# EasyEDA Pro project 小张FOC-STM32G431CBU6.epro, board PCB4
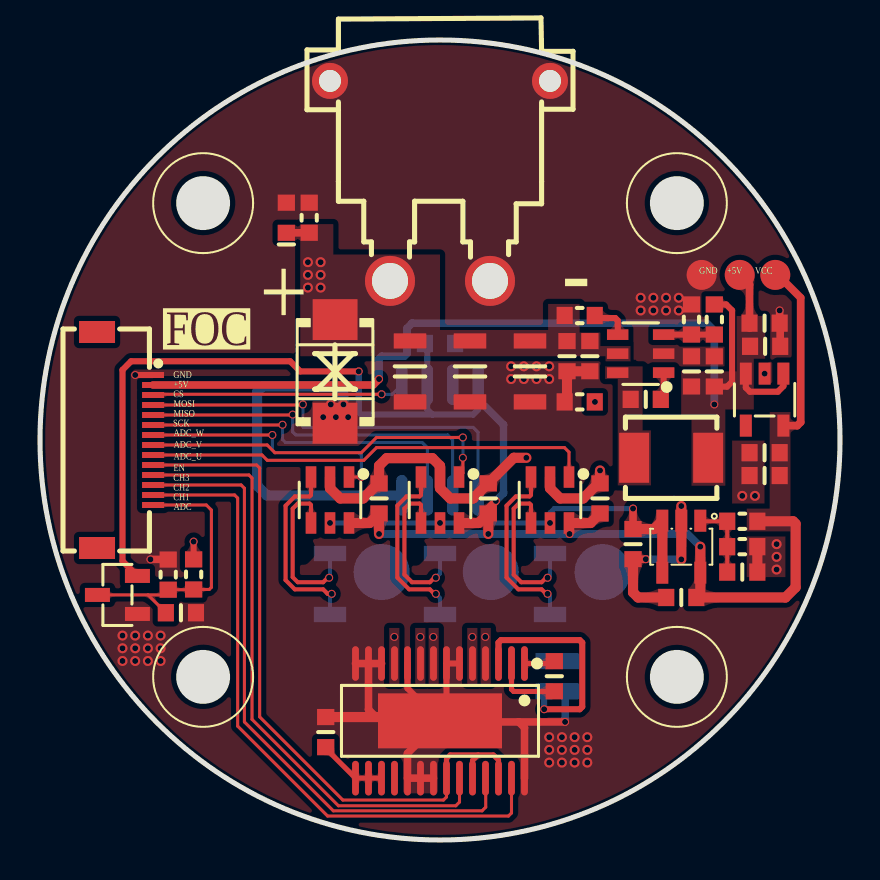
[diagram p9: board, top side]
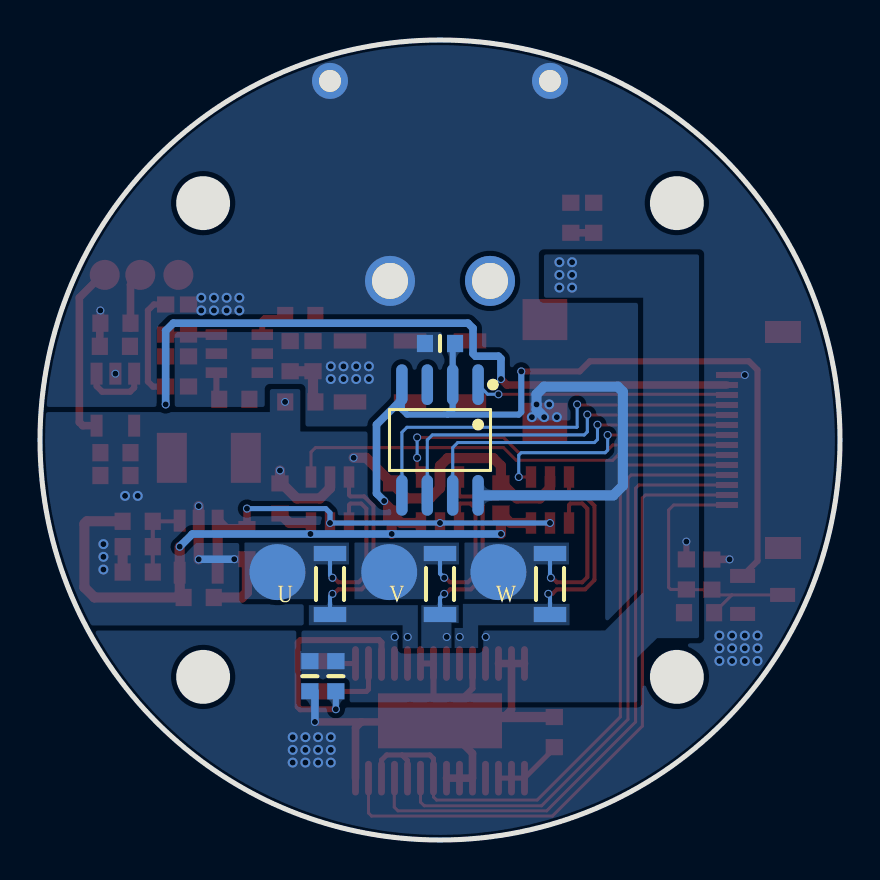
[diagram p10: board, bottom side, seen from below]

Outline 40 x 40 mm; copper layers: Top Layer, Bottom Layer. Coordinates in mm from the lower left corner of the outline.
Outline path: circle c20,20 r20
Stack: Top Layer 0.035mm - / Dielectric1 1.51mm FR4 er 4.5 / Bottom Layer 0.035mm -

## Design rules (mm)
template: 自定义配置
spacing copperThickness1oz (default): track to track 0.102, other pairs 0.102 to 0.127
spacing copperThickness2oz: track to track 0.203, other pairs 0.152 to 0.3
track width copperThickness1oz (default): min 0.127, default 0.152, max 2.54
track width copperThickness2oz: min 0.203, default 0.254, max 2.54
differential pair differentialPair (default): width min 0.127, default 0.152, max 2.54; gap min 0.152, default 0.152
via viaSize (default): diameter min 0.399, default 0.5, max 10; hole min 0.3, default 0.3, max 6.299

## Placement (name value [footprint] x y rotation side)
C1  10nF  [C0603_SMALL]  25.72 8.19 90 top
C2  100nF  [C0603_SMALL]  25.21 8.19 270 bottom
C3  100nF  [C0603_SMALL]  30.29 22.03 180 top
C4  10uF  [C0603_SMALL]  26.35 24.19 270 top
C5  10uF  [C0603_SMALL]  27.49 24.19 270 top
C6  10uF  [C0603_SMALL]  32.57 23.43 270 top
C7  100nF  [C0603_SMALL]  33.72 23.43 270 top
C8  1uF  [C0603_SMALL]  36.23 25.84 180 top
C9  100nF  [C0603_SMALL]  36.26 24.68 180 top
C10  1uF  [C0603_SMALL]  36.23 19.36 0 top
C11  100nF  [C0603_SMALL]  36.23 18.22 0 top
C12  100nF  [C0603_SMALL]  26.51 8.19 90 bottom
C13  470nF  [C0603_SMALL]  14.28 5.39 270 top
C14  100nF  [C0603_SMALL]  32.06 12.13 180 top
C15  100nF  [C0603_SMALL]  28 17.08 90 top
C16  100nF  [C0603_SMALL]  22.41 17.08 90 top
C17  100nF  [C0603_SMALL]  16.95 17.08 90 top
C18  100nF  [C0603_SMALL]  35.11 13.4 0 top
C19  100nF  [C0603_SMALL]  29.65 14.79 270 top
C20  100nF  [C0603_SMALL]  20 24.83 180 bottom
C21  22uF  [C1206_SMALL]  18.5 23.43 90 top
C22  22uF  [C1206_SMALL]  21.5 23.43 90 top
C23  22uF  [C1206_SMALL]  24.5 23.43 90 top
C24  100nF  [C0603_SMALL]  7.05 11.36 0 top
CN1  XT30PW-M  [CONN-TH_XT30PW-M]  20 32.95 180 top
D1  BAV99  [SOT-23-3_L2.9-W1.3-P1.90-LS2.4-BR]  3.87 12.25 0 top
D2  SMBJ36CA  [SMB_L4.6-W3.6-LS5.3-BI]  14.75 23.43 270 top
FPC1  FPC-05F-14PH15  [FPC-SMD_14P-P0.50_XUNPU_FPC-05F-14PH15]  4.25 20 270 top
L1  4.7uH  [IND-SMD_L4.5-W4.0-1]  31.56 19.11 0 top
LED1  -  [LED0603_RED_SMALL]  12.32 31.11 90 top
NOREF  -  [Pad_e13557]  34.99 28.25 0 top
NOREF#2  -  [Pad_e1364]  17.08 13.4 0 top
NOREF#3  -  [Pad_e1384]  22.54 13.4 0 top
NOREF#4  -  [Pad_e1385]  28.13 13.4 0 top
NOREF#5  -  [Pad_e13556]  33.08 28.25 0 top
NOREF#6  -  [Pad_e13558]  36.76 28.25 0 top
R1  0Ω  [R0603_SMALL]  26.99 21.91 0 top
R2  52.3K  [R0603_SMALL]  33.72 26.02 90 top
R3  10kΩ  [R0603_SMALL]  26.99 26.22 0 top
R4  10K  [R0603_SMALL]  32.57 26.02 270 top
R5  10K  [R0603_SMALL]  35.11 15.94 0 top
R6  10K  [R0603_SMALL]  35.11 14.67 180 top
R7  5mΩ  [R1206_SMALL]  25.5 12.8 90 bottom
R8  5mΩ  [R1206_SMALL]  20 12.8 90 bottom
R9  5mΩ  [R1206_SMALL]  14.5 12.8 90 bottom
R10  10K  [R0603_SMALL]  13.46 31.11 270 top
R11  30K  [R0603_SMALL]  7.68 13.28 90 top
R12  10K  [R0603_SMALL]  6.41 13.27 90 top
TP1  M2.5螺丝孔  [X-M2.5螺丝孔]  8.16 8.16 0 top
TP2  M2.5螺丝孔  [X-M2.5螺丝孔]  8.16 31.84 0 top
TP3  M2.5螺丝孔  [X-M2.5螺丝孔]  31.84 8.16 0 top
TP4  M2.5螺丝孔  [X-M2.5螺丝孔]  31.84 31.84 0 top
U1  DRV8313PWPR  [htssop-28_l9.8-w4.5-p0.65-ls6.6-bl-ep]  20 5.96 180 top
U2  RY8411  [SOT-23-6_L2.9-W1.6-P0.95-LS2.8-TL]  30.03 24.32 180 top
U3  RT9013-3.3GB  [SOT-23-5_L2.9-W1.6-P0.94-LS2.8-BL]  36.23 22.02 180 top
U4  LMV321  [SOT-23-5_L3.0-W1.7-P0.95-LS2.8-BR]  32.06 14.67 90 top
U5  INA181A2IDBVR  [SOT-23-6_L2.9-W1.6-P0.95-LS2.8-BL]  25.5 17 180 top
U6  INA181A2IDBVR  [SOT-23-6_L2.9-W1.6-P0.95-LS2.8-BL]  20 17 180 top
U7  INA181A2IDBVR  [SOT-23-6_L2.9-W1.6-P0.95-LS2.8-BL]  14.5 17 180 top
U8  MT6816CT-ACD  [SOP-8_L5.0-W4.0-P1.27-LS6.0-BL]  20 20 0 bottom

## Footprints (pads in the part's own frame, mm; a bottom-side part is the same pattern mirrored in y, then rotated)
C0603_SMALL
  rect 0.806x0.864 smd: 1(-0.753,0) 2(0.753,0)
C1206_SMALL
  rect 0.762x1.625 smd: 1(-1.524,0) 2(1.524,0)
CONN-TH_XT30PW-M
  round 2.5 hole 1.8: 1(-2.5,5) 2(2.5,5)
  round 1.8 hole 1.1: 3(5.5,-5) 4(-5.5,-5)
FPC-SMD_14P-P0.50_XUNPU_FPC-05F-14PH15
  rect 0.3x1.1 smd: 1(-3.25,1.4) 2(-2.75,1.4) 3(-2.25,1.4) 4(-1.75,1.4) 5(-1.25,1.4) 6(-0.75,1.4) 7(-0.25,1.4) 8(0.25,1.4) 9(0.75,1.4) 10(1.25,1.4) 11(1.75,1.4) 12(2.25,1.4) 13(2.75,1.4) 14(3.25,1.4)
  rect 1.1x1.8 smd: 15(5.4,-1.4) 16(-5.4,-1.4)
htssop-28_l9.8-w4.5-p0.65-ls6.6-bl-ep
  oval 0.343x1.732 smd: 1(-4.225,-2.866) 2(-3.575,-2.866) 3(-2.925,-2.866) 4(-2.275,-2.866) 5(-1.625,-2.866) 6(-0.975,-2.866) 7(-0.325,-2.866) 8(0.325,-2.866) 9(0.975,-2.866) 10(1.625,-2.866) 11(2.275,-2.866) 12(2.925,-2.866) 13(3.575,-2.866) 14(4.225,-2.866) 15(4.225,2.866) 16(3.575,2.866) 17(2.925,2.866) 18(2.275,2.866) 19(1.625,2.866) 20(0.975,2.866) 21(0.325,2.866) 22(-0.325,2.866) 23(-0.975,2.866) 24(-1.625,2.866) 25(-2.275,2.866) 26(-2.925,2.866) 27(-3.575,2.866) 28(-4.225,2.866)
  rect 6.2x2.75 smd: 29(0,0)
IND-SMD_L4.5-W4.0-1
  rect 1.5x2.5 smd: 1(-1.85,0) 2(1.85,0)
LED0603_RED_SMALL
  rect 0.806x0.864 smd: 1(0.753,0) 2(-0.753,0)
Pad_e1364
  round 2.8 smd far side: 7(0,0)
Pad_e1384
  round 2.8 smd far side: 7(0,0)
Pad_e1385
  round 2.8 smd far side: 7(0,0)
Pad_e13556
  round 1.5 smd: TP1(0,0)
Pad_e13557
  round 1.5 smd: TP2(0,0)
Pad_e13558
  round 1.5 smd: TP3(0,0)
R0603_SMALL
  rect 0.806x0.864 smd: 1(-0.753,0) 2(0.753,0)
R1206_SMALL
  rect 0.762x1.625 smd: 1(-1.524,0) 2(1.524,0)
SMB_L4.6-W3.6-LS5.3-BI
  rect 2.047x2.241 smd: 1(-2.591,0) 2(2.591,0)
SOP-8_L5.0-W4.0-P1.27-LS6.0-BL
  oval 0.574x2.035 smd: 1(-1.905,-2.768) 2(-0.635,-2.768) 3(0.635,-2.768) 4(1.905,-2.768) 5(1.905,2.768) 6(0.635,2.768) 7(-0.635,2.768) 8(-1.905,2.768)
SOT-23-3_L2.9-W1.3-P1.90-LS2.4-BR
  rect 1.25x0.7 smd: 1(1,-0.95) 2(1,0.95) 3(-1,0)
SOT-23-5_L2.9-W1.6-P0.94-LS2.8-BL
  rect 0.6x1.1 smd: 1(-0.94,-1.3) 2(0,-1.3) 3(0.94,-1.3) 4(0.94,1.3) 5(-0.94,1.3)
SOT-23-5_L3.0-W1.7-P0.95-LS2.8-BR
  rect 1.1x0.6 smd: 1(1.3,-0.95) 2(1.3,0) 3(1.3,0.95) 4(-1.3,0.95) 5(-1.3,-0.95)
SOT-23-6_L2.9-W1.6-P0.95-LS2.8-BL
  rect 0.532x1.072 smd: 1(-0.95,-1.149) 2(0,-1.149) 3(0.95,-1.149) 4(0.95,1.149) 5(0,1.149) 6(-0.95,1.149)
SOT-23-6_L2.9-W1.6-P0.95-LS2.8-TL
  rect 1.072x0.532 smd: 1(-1.149,0.95) 2(-1.149,0) 3(-1.149,-0.95) 4(1.149,-0.95) 5(1.149,0) 6(1.149,0.95)

## Nets
As in the schematic, except:
+5V: C6.2 C7.2 C8.2 C9.2 FPC1.2 L1.2 NOREF.TP2 R2.2 U3.1 U3.3
AVCC: C10.2 C11.2 C14.1 C15.1 C16.1 C17.1 C20.2 D1.2 NOREF#6.TP3 R5.2 U3.5 U4.5 U5.6 U6.6 U7.6 U8.2 U8.4
GND: C4.2 C5.2 C6.1 C7.1 C8.1 C9.1 C12.1 C13.1 C20.1 C21.1 C22.1 C23.1 C24.2 CN1.1 CN1.3 CN1.4 D1.1 D2.2 FPC1.1 LED1.1 NOREF#5.TP1 R1.1 R4.1 R10.1 R12.2 U1.6 U1.7 U1.10 U1.12 U1.13 U1.14 U1.19 U1.20 U1.21 U1.28 U1.29 U2.2 U3.2 U8.8
U: NOREF#4.7 R7.2 U5.4
V: NOREF#3.7 R8.2 U6.4
W: NOREF#2.7 R9.2 U7.4

Pads without a net: FPC1 15 16; U1 18; U3 4; U8 3

## Via types
v1: diameter 0.4, hole 0.3, Top Layer to Bottom Layer, 44 vias
v2: diameter 0.5, hole 0.299, Top Layer to Bottom Layer, 56 vias

## Routing (per net, layer and track width the routed paths; a pad name or vN(x,y) marks a point on that pad's centre or on a via; arc(x,y) is an arc through that point)
1V65: length 21
  Top Layer w0.381: C19.1 v1(29.65,16.57)
  Top Layer w0.508: U4.4 U4.3 30.69,15.55 C19.1
  Bottom Layer w0.254: v1(14.5,15.85) v1(20,15.85) v1(25.5,15.85) 25.5,16.36 25.72,16.57 v1(29.65,16.57)
+5V: length 46.2
  Top Layer w0.305: C7.2 33.72,22.67 34.35,22.67 34.6,22.92 34.6,26.48 34.31,26.78 R2.2 ; U3.3 35.29,22.62 35.49,22.41 36.89,22.41 37.17,22.69 U3.1
  Top Layer w0.381: 35.48,25.59 35.48,27.77 35.11,28.13 ; FPC1.2 16.65,22.75 v1(16.95,23.05)
  Bottom Layer w0.381: v1(16.95,23.05) 16.95,24.06 17.08,24.19 18.22,24.19 18.35,24.32 18.35,25.59 18.6,25.84 33.34,25.84 33.72,25.46 v1(33.72,21.78)
AGND: length 28
  Top Layer w0.381: C19.2 v1(30.29,14.04) ; v1(27.75,21.91) R1.2
  Top Layer w0.508: v1(32.06,14.03) U4.2 v1(32.06,16.7) ; 27.91,17.83 27.16,17.08 26.01,17.08 25.5,17.59 U5.2 ; 35.87,13.65 35.87,14.79 ; 16.91,17.83 16.16,17.08 15.01,17.08 14.5,17.59 U7.2 ; C14.2 29.91,12.13 29.65,12.38 C19.2 ; v1(24.32,19.11) 23.69,19.11 C16.2 21.66,17.08 20.51,17.08 20,17.59 U6.2 20,18.71 19.62,19.09 17.33,19.09 16.95,18.71 C17.2 ; C15.2 v1(28,18.48)
  Bottom Layer w0.381: v1(32.06,14.03) 32.06,14.04 v1(30.29,14.04)
  vias: v2(35.11,17.21) v2(35.75,17.21) v2(36.83,14.79) v2(36.83,14.16) v2(36.83,13.52)
AVCC: length 88.6
  Top Layer w0.305: v1(15.94,23.43) 13.01,23.43 12.51,23.94 4.56,23.94 4.12,23.5 4.12,13.95 D1.2
  Top Layer w0.381: 36.51,28.13 37.02,28.13 38.03,27.11 38.03,20.89 37.86,20.72 37.17,20.72 ; U5.6 26.48,15.82 v1(26.48,15.3) ; C16.1 22.41,16.57 v1(22.79,16.95)
  Top Layer w0.508: v1(16.95,15.3) C17.1 16.48,15.85 U7.6 ; U6.6 21.94,15.85 C16.1 v1(22.41,15.3) ; R5.2 37.65,15.94 37.78,15.81 37.78,12.63 37.27,12.13 C14.1 33.01,12.32 U4.5 v1(33.01,14.67) ; U5.6 27.53,15.85 C15.1
  Bottom Layer w0.305: 19.62,21.27 19.37,21.52 U8.2 19.37,24.71 C20.2 ; 19.62,21.27 16.06,21.27 15.94,21.4 v1(15.94,23.43) ; 19.62,21.27 21.65,21.27 21.91,21.52 21.91,22.04
  Bottom Layer w0.381: v1(22.79,16.95) 23.18,17.33 23.18,20.77 21.91,22.04 U8.4 ; v1(33.01,14.67) 32.38,15.3 v1(26.48,15.3) v1(22.41,15.3) v1(16.95,15.3)
GND: length 56.7
  Top Layer w0.305: U1.10 18.38,7.58 19.81,6.15 ; FPC1.1 v1(4.76,23.25) ; U1.29 20.32,6.28 U1.7 U1.6
  Top Layer w0.381: v1(36.98,26.48) 36.98,25.59 37.01,25.56 37.01,24.56 ; U1.28 24.22,5.61 23.94,5.9 ; U1.14 U1.13 ; U1.13 U1.12 ; U1.13 16.43,6.52 16.8,6.15 ; 23.94,5.9 20.06,5.9 U1.29 18.38,4.33 U1.19 U1.20 U1.21 ; 23.94,5.9 v1(26.25,5.9) ; v1(5.52,14.03) 6.4,14.03 R12.2
  Top Layer w0.508: R1.1 26.35,22.02 C4.2 C5.2 ; U1.29 19.81,6.15 C13.1
  Bottom Layer w0.381: 26.25,7.44 v1(26.25,5.9)
  Bottom Layer w0.508: 14.92,21.27 15.17,21.52 v2(15.17,21.78) 15.17,22.29 14.79,22.67 11.11,22.67 10.86,22.41 10.86,17.71 11.34,17.23 U8.8
  vias: v1(36.23,23.32) v2(4.12,10.22) v2(4.12,9.59) v2(4.12,8.95) v2(4.76,10.22) v2(4.76,9.59) v2(4.76,8.95) v2(5.4,10.22) v2(5.4,9.59) v2(5.4,8.95) v2(6.03,10.22) v2(6.03,9.59) v2(6.03,8.95) v2(14.16,21.14) v2(14.54,21.78) v2(14.79,21.14) v2(15.41,21.14) v2(23.56,23.68) v2(23.56,23.05) v2(24.19,23.68) v2(24.19,23.05) v2(24.83,23.68) v2(24.83,23.05) v2(25.46,23.68) v2(25.46,23.05) v2(25.46,5.14) v2(25.46,4.51) v2(25.46,3.87) v2(26.1,5.14) v2(26.1,4.51) v2(26.1,3.87) v2(26.73,5.14) v2(26.73,4.51) v2(26.73,3.87) v2(27.37,5.14) v2(27.37,4.51) v2(27.37,3.87) v2(30.03,27.11) v2(30.03,26.48) v2(30.67,27.11) v2(30.67,26.48) v2(31.3,27.11) v2(31.3,26.48) v2(31.94,27.11) v2(31.94,26.48)
ADC: length 14
  Top Layer w0.152: 5.4,12.25 C24.1 ; 5.4,12.25 D1.3 ; 5.4,12.25 6.15,12.25 R12.1 7.67,12.52 R11.1 8.46,12.53 8.57,12.63 8.57,16.5 8.32,16.75 FPC1.14
ADC_U: length 22.5
  Top Layer w0.152: 5.66,19.24 FPC1.9 11.1,19.25 11.36,18.98 16.19,18.98 16.82,19.62 26.22,19.62 26.45,19.39 U5.1
ADC_V: length 18
  Top Layer w0.152: v1(21.14,19.11) 21.14,18.34 U6.1 ; v1(21.14,20.13) 16.82,20.13 16.06,19.36 11.75,19.36 11.36,19.75 FPC1.8
  Bottom Layer w0.152: v1(21.14,20.13) v1(21.14,19.11)
ADC_W: length 13
  Top Layer w0.152: FPC1.7 v1(11.62,20.25) ; U7.1 v1(16.06,18.15)
  Bottom Layer w0.152: v1(16.06,18.15) 16.06,19.24 15.94,19.36 11.75,19.36 11.62,19.49 v1(11.62,20.25)
DCBUS: length 2
  Top Layer w0.305: R11.2 v1(7.68,14.92)
  Top Layer w0.381: LED1.2 R10.2
  vias: v1(17.71,10.15) v1(22.26,10.15) v2(13.4,28.89) v2(13.4,28.25) v2(13.4,27.62) v2(14.03,28.89) v2(14.03,28.25) v2(14.03,27.62)
NDRVEN: length 35.8
  Top Layer w0.152: U1.22 20.32,2.15 20.17,2 15.14,2 10.98,6.16 10.98,18.6 10.83,18.75 FPC1.10
  Top Layer w0.254: 21.91,4.25 22.67,4.25 22.93,3.99 U1.26 ; 21.91,4.25 21.62,3.97 U1.24 ; 21.91,4.25 20.51,4.25 20.32,4.07 U1.22
SPI1_CS: length 12.7
  Top Layer w0.152: v1(17.08,22.29) 5.69,22.29 FPC1.3
  Bottom Layer w0.152: U8.1 17.61,22.29 v1(17.08,22.29)
SPI1_MISO: length 18.8
  Top Layer w0.152: v1(12.63,21.27) 12.61,21.25 FPC1.5
  Bottom Layer w0.152: v1(12.63,21.27) 12.63,20.41 12.79,20.25 20.38,20.25 20.63,20 U8.6
SPI1_MOSI: length 20.6
  Top Layer w0.152: v1(13.14,21.78) 13.11,21.75 FPC1.4
  Bottom Layer w0.152: v1(13.14,21.78) 13.14,20.66 13.17,20.64 21.65,20.64 21.91,20.38 U8.5
SPI1_SCK: length 17
  Top Layer w0.152: FPC1.6 12.11,20.75 v1(12.13,20.76)
  Bottom Layer w0.152: v1(12.13,20.76) 12.13,20.03 12.28,19.87 19.11,19.87 19.37,19.62 U8.7
TIM4_CH1: length 30.5
  Top Layer w0.152: FPC1.11 10.45,18.25 10.6,18.09 10.6,6.03 14.92,1.71 20.79,1.71 20.97,1.9 U1.23
TIM4_CH2: length 31.8
  Top Layer w0.152: FPC1.12 10.06,17.75 10.22,17.59 10.22,5.9 14.67,1.46 22.1,1.46 22.29,1.64 22.29,3.08 U1.25
TIM4_CH3: length 33.1
  Top Layer w0.152: U1.27 23.57,1.35 23.42,1.2 14.38,1.2 9.88,5.7 9.88,17.1 9.73,17.25 FPC1.13
U: length 8.4
  Top Layer w0.203: v1(25.38,13.11) 25.31,13.11 25.08,12.89 24.06,12.89 23.68,13.27 23.68,16.57 23.94,16.82 24.48,16.82 24.55,16.75 U5.4
  Bottom Layer w0.203: v1(25.38,13.11) 25.5,13.23 R7.2
U_OUT: length 9.4
  Top Layer w0.203: U5.3 24.55,17.25 24.48,17.18 23.79,17.18 23.33,16.72 23.33,13.12 23.92,12.53 25.08,12.53 25.31,12.31 v1(25.38,12.31)
  Bottom Layer w0.203: R7.1 25.5,12.19 v1(25.38,12.31)
  vias: v1(21.61,10.15)
V: length 8.3
  Top Layer w0.203: v1(19.79,13.11) 19.72,13.11 19.49,12.89 18.6,12.89 18.22,13.27 18.22,16.57 18.47,16.82 18.98,16.82 19.05,16.75 U6.4
  Bottom Layer w0.203: v1(19.79,13.11) 20,13.32 R8.2
V_OUT: length 9.3
  Top Layer w0.203: v1(19.79,12.31) 19.72,12.31 19.49,12.53 18.46,12.53 17.87,13.12 17.87,16.72 18.33,17.18 18.98,17.18 19.05,17.25 U6.3
  Bottom Layer w0.203: R8.1 20,12.1 v1(19.79,12.31)
  vias: v1(19.66,10.15)
W: length 8.6
  Top Layer w0.203: v1(14.46,13.11) 14.38,13.11 14.16,12.89 12.89,12.89 12.63,13.14 12.63,16.57 12.89,16.82 13.48,16.82 13.55,16.75 U7.4
  Bottom Layer w0.203: R9.2 14.5,13.16 v1(14.46,13.11)
W_OUT: length 9.8
  Top Layer w0.203: v1(14.58,12.31) 14.38,12.31 14.16,12.53 12.74,12.53 12.28,13 12.28,16.72 12.74,17.18 13.48,17.18 13.55,17.25 U7.3
  Bottom Layer w0.203: R9.1 14.5,12.22 v1(14.58,12.31)
  vias: v1(19.01,10.15)
$1N335: length 1.5
  Top Layer w0.254: C1.2 25.6,8.82 U1.1
$1N336: length 3.5
  Top Layer w0.254: U1.2 23.57,7.53 23.68,7.43 25.71,7.43 C1.1
$1N337: length 11.4
  Top Layer w0.305: U1.3 22.93,9.87 23.05,10 26.99,10 27.11,9.87 27.11,6.67 26.99,6.54 v1(25.21,6.54)
  Bottom Layer w0.305: C2.2 v1(25.21,6.54)
$1N347: length 3.5
  Top Layer w0.254: C13.2 14.28,4.58 U1.15 U1.16 U1.17
$1N1342: length 1.9
  Top Layer w0.305: U2.4 28.89,25.27 28.89,25.97 28.76,26.1 27.74,26.1
$1N1348: length 1.4
  Top Layer w0.305: C3.1 31.18,22.17 U2.1
$1N1350: length 2.5
  Top Layer w0.305: U2.3 33.71,25.27 R2.1
$1N7698: length 3.6
  Top Layer w0.203: U4.1 33.04,15.94 R5.1 34.36,13.65

## Copper pours and planes (outline as drawn; the poured copper is in the pictures)
+5V on Top Layer: 32.05,26.2 36.26,26.2 36.26,17.71 32.05,17.71
AGND on Top Layer: 35.34,15.17 37.27,15.17 37.27,13.14 35.34,13.14
AGND on Top Layer: 34.6,19.97 36.22,19.97 36.22,16.83 34.6,16.83
AGND on Bottom Layer: 40.8,10.73 40.8,21.4 28.51,21.4 28.51,22.54 26.98,22.54 26.98,20.42 12,20.42 12,10.73
AVCC on Top Layer: 35.34,21.4 37.53,21.4 37.53,15.43 35.34,15.43
GND on Top Layer: 29.68,27.42 34.22,27.42 34.22,23.68 29.68,23.68
GND on Top Layer: 50.4,20.54 50.36,21.63 50.29,22.71 50.17,23.79 50.02,24.86 49.82,25.93 49.59,26.99 49.33,28.04 49.02,29.08 48.68,30.11 48.3,31.13 47.88,32.13 47.43,33.12 46.95,34.09 46.43,35.04 45.87,35.97 45.29,36.89 44.67,37.78 44.02,38.65 43.34,39.49 42.63,40.31 41.89,41.1 41.12,41.87 40.32,42.61 39.5,43.32 38.66,44 37.79,44.65 36.9,45.27 35.99,45.86 35.05,46.41 34.1,46.93 33.13,47.42 32.14,47.87 31.14,48.28 30.13,48.66 29.1,49 28.06,49.31 27,49.58 25.94,49.81 24.88,50 23.8,50.16 22.72,50.27 21.64,50.35 20.56,50.39 19.47,50.39 18.39,50.35 17.31,50.27 16.23,50.16 15.15,50 14.09,49.81 13.02,49.58 11.97,49.31 10.93,49 9.9,48.66 8.89,48.28 7.88,47.87 6.9,47.42 5.93,46.93 4.97,46.41 4.04,45.86 3.13,45.27 2.24,44.65 1.37,44 0.52,43.32 -0.3,42.61 -1.09,41.87 -1.86,41.1 -2.6,40.31 -3.31,39.49 -3.99,38.65 -4.64,37.78 -5.26,36.89 -5.84,35.97 -6.4,35.04 -6.92,34.09 -7.4,33.12 -7.85,32.13 -8.27,31.13 -8.65,30.11 -8.99,29.08 -9.3,28.04 -9.56,26.99 -9.79,25.93 -9.99,24.86 -10.14,23.79 -10.26,22.71 -10.34,21.63 -10.37,20.54 -10.37,19.46 -10.34,18.37 -10.26,17.29 -10.14,16.21 -9.99,15.14 -9.79,14.07 -9.56,13.01 -9.3,11.96 -8.99,10.92 -8.65,9.89 -8.27,8.87 -7.85,7.87 -7.4,6.88 -6.92,5.91 -6.4,4.96 -5.84,4.03 -5.26,3.11 -4.64,2.22 -3.99,1.35 -3.31,0.51 -2.6,-0.31 -1.86,-1.1 -1.09,-1.87 -0.3,-2.61 0.52,-3.32 1.37,-4 2.24,-4.65 3.13,-5.27 4.04,-5.86 4.97,-6.41 5.93,-6.93 6.9,-7.42 7.88,-7.87 8.89,-8.28 9.9,-8.66 10.93,-9 11.97,-9.31 13.02,-9.58 14.09,-9.81 15.15,-10 16.23,-10.16 17.31,-10.27 18.39,-10.35 19.47,-10.39 20.56,-10.39 21.64,-10.35 22.72,-10.27 23.8,-10.16 24.88,-10 25.94,-9.81 27,-9.58 28.06,-9.31 29.1,-9 30.13,-8.66 31.14,-8.28 32.14,-7.87 33.13,-7.42 34.1,-6.93 35.05,-6.41 35.99,-5.86 36.9,-5.27 37.79,-4.65 38.66,-4 39.5,-3.32 40.32,-2.61 41.12,-1.87 41.89,-1.1 42.63,-0.31 43.34,0.51 44.02,1.35 44.67,2.22 45.29,3.11 45.87,4.03 46.43,4.96 46.95,5.91 47.43,6.88 47.88,7.87 48.3,8.87 48.68,9.89 49.02,10.92 49.33,11.96 49.59,13.01 49.82,14.07 50.02,15.14 50.17,16.21 50.29,17.29 50.36,18.37 50.4,19.46
GND on Bottom Layer: 45.76,20.51 45.72,21.52 45.65,22.52 45.53,23.53 45.37,24.53 45.17,25.52 44.94,26.5 44.66,27.48 44.35,28.44 44,29.39 43.61,30.32 43.19,31.24 42.73,32.14 42.23,33.02 41.71,33.89 41.14,34.73 40.55,35.54 39.92,36.34 39.27,37.11 38.58,37.85 37.86,38.57 37.12,39.25 36.35,39.91 35.56,40.53 34.74,41.13 33.9,41.69 33.04,42.22 32.16,42.71 31.25,43.17 30.34,43.6 29.4,43.98 28.45,44.33 27.49,44.65 26.52,44.92 25.53,45.16 24.54,45.35 23.54,45.51 22.54,45.63 21.53,45.71 20.52,45.75 19.51,45.75 18.5,45.71 17.49,45.63 16.49,45.51 15.49,45.35 14.49,45.16 13.51,44.92 12.54,44.65 11.58,44.33 10.63,43.98 9.69,43.6 8.77,43.17 7.87,42.71 6.99,42.22 6.13,41.69 5.29,41.13 4.47,40.53 3.68,39.91 2.91,39.25 2.16,38.57 1.45,37.85 0.76,37.11 0.11,36.34 -0.52,35.54 -1.11,34.73 -1.68,33.89 -2.21,33.02 -2.7,32.14 -3.16,31.24 -3.58,30.32 -3.97,29.39 -4.32,28.44 -4.63,27.48 -4.91,26.5 -5.14,25.52 -5.34,24.53 -5.5,23.53 -5.62,22.52 -5.7,21.52 -5.74,20.51 -5.74,19.49 -5.7,18.48 -5.62,17.48 -5.5,16.47 -5.34,15.47 -5.14,14.48 -4.91,13.5 -4.63,12.52 -4.32,11.56 -3.97,10.61 -3.58,9.68 -3.16,8.76 -2.7,7.86 -2.21,6.98 -1.68,6.11 -1.11,5.27 -0.52,4.46 0.11,3.66 0.76,2.89 1.45,2.15 2.16,1.43 2.91,0.75 3.68,0.09 4.47,-0.53 5.29,-1.13 6.13,-1.69 6.99,-2.22 7.87,-2.71 8.77,-3.17 9.69,-3.6 10.63,-3.98 11.58,-4.33 12.54,-4.65 13.51,-4.92 14.49,-5.16 15.49,-5.35 16.49,-5.51 17.49,-5.63 18.5,-5.71 19.51,-5.75 20.52,-5.75 21.53,-5.71 22.54,-5.63 23.54,-5.51 24.54,-5.35 25.53,-5.16 26.52,-4.92 27.49,-4.65 28.45,-4.33 29.4,-3.98 30.34,-3.6 31.25,-3.17 32.16,-2.71 33.04,-2.22 33.9,-1.69 34.74,-1.13 35.56,-0.53 36.35,0.09 37.12,0.75 37.86,1.43 38.58,2.15 39.27,2.89 39.92,3.66 40.55,4.46 41.14,5.27 41.71,6.11 42.23,6.98 42.73,7.86 43.19,8.76 43.61,9.68 44,10.61 44.35,11.56 44.66,12.52 44.94,13.5 45.17,14.48 45.37,15.47 45.53,16.47 45.65,17.48 45.72,18.48 45.76,19.49
DCBUS on Top Layer: 13.01,30.8 29.53,30.8 29.53,23.93 13.01,23.93
DCBUS on Top Layer: 17.46,10.6 17.97,10.6 17.97,7.81 17.46,7.81
DCBUS on Top Layer: 22.03,10.6 22.54,10.6 22.54,7.81 22.03,7.81
DCBUS on Bottom Layer: 24.7,9.46 26.99,9.46 26.99,8.44 24.7,8.44
DCBUS on Bottom Layer: 7.05,29.28 7.05,10.09 9.15,10.09 10.14,9.11 10.14,6.88 26.93,6.88 26.93,10.47 11.75,10.47 9.84,12.38 9.84,27.11 14.8,27.11 14.8,29.28
U on Bottom Layer: 24.55,14.87 29.78,14.87 29.78,12.05 24.55,12.05
U_OUT on Top Layer: 21.36,10.6 21.87,10.6 21.87,7.81 21.36,7.81
U_OUT on Bottom Layer: 21.11,11.74 26.56,11.74 26.56,9.59 21.11,9.59
V on Bottom Layer: 19.05,14.87 24.28,14.87 24.28,12.05 19.05,12.05
V_OUT on Top Layer: 19.43,10.6 19.94,10.6 19.94,7.81 19.43,7.81
V_OUT on Bottom Layer: 19.07,11.74 20.94,11.74 20.94,9.6 19.07,9.6
W on Bottom Layer: 13.53,14.92 18.78,14.92 18.78,11.87 15.2,11.87 15.2,13.83 13.53,13.83
W on Bottom Layer: 13.55,14.87 18.78,14.87 18.78,12.05 13.55,12.05
W_OUT on Top Layer: 18.76,10.6 19.27,10.6 19.27,7.81 18.76,7.81
W_OUT on Bottom Layer: 13.52,11.81 19.27,11.81 19.27,9.6 13.52,9.6
$1N1349 on Top Layer: 28.25,23.68 30.55,23.68 30.55,17.73 28.25,17.73

Small or netless copper shapes (teardrops, artwork), in the pictures only: 166 on Top Layer, 53 on Bottom Layer

## Text on the board
Bottom Silkscreen Layer: W | V | U
Top Silkscreen Layer: SCK | GND | CS | CH3 | CH2 | CH1 | EN | +5V | MOSI | MISO | ADC_W | ADC_V | ADC_U | ADC | VCC | FOC | + | -
